# EAGLE design Mega Breakout with more GNDs 2 (EAGLE 9.6.2)
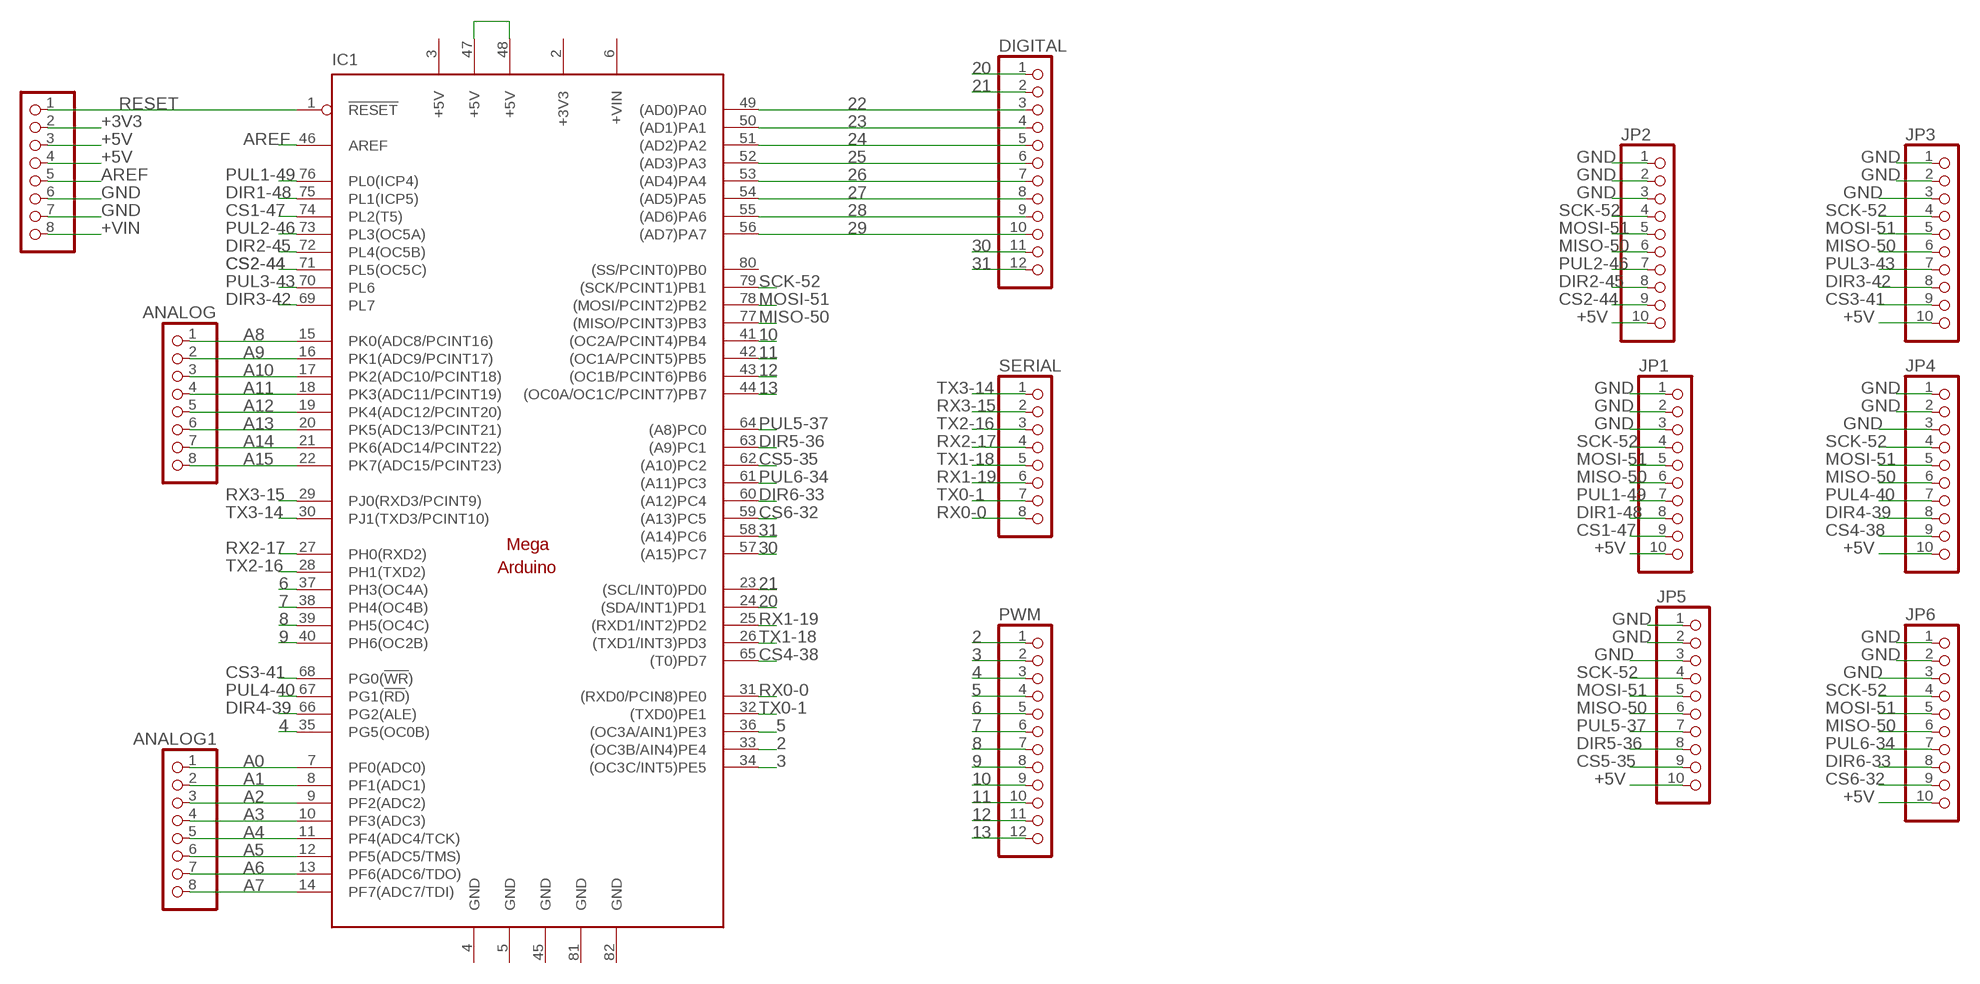
[diagram p0: schematic, sheet 1]

## Parts
ANALOG  PINHD-1X8  [1X08]
ANALOG1  PINHD-1X8  [1X08]
DIGITAL  PINHD-1X12  [1X12]
IC1  MEGAARDUINO_1  [MEGA_ARDUINO]
JP1  PINHD-1X10  [1X10]
JP2  PINHD-1X10  [1X10]
JP3  PINHD-1X10  [1X10]
JP4  PINHD-1X10  [1X10]
JP5  PINHD-1X10  [1X10]
JP6  PINHD-1X10  [1X10]
POWER  PINHD-1X8  [1X08]
PWM  PINHD-1X12  [1X12]
SERIAL  PINHD-1X8  [1X08]

## Nets
2: IC1.33((OC3B/AIN4)PE4) PWM.1
3: IC1.34((OC3C/INT5)PE5) PWM.2
4: IC1.35(PG5(OC0B)) PWM.3
5: IC1.36((OC3A/AIN1)PE3) PWM.4
6: IC1.37(PH3(OC4A)) PWM.5
7: IC1.38(PH4(OC4B)) PWM.6
8: IC1.39(PH5(OC4C)) PWM.7
9: IC1.40(PH6(OC2B)) PWM.8
10: IC1.41((OC2A/PCINT4)PB4) PWM.9
11: IC1.42((OC1A/PCINT5)PB5) PWM.10
12: IC1.43((OC1B/PCINT6)PB6) PWM.11
13: IC1.44((OC0A/OC1C/PCINT7)PB7) PWM.12
20: DIGITAL.1 IC1.24((SDA/INT1)PD1)
21: DIGITAL.2 IC1.23((SCL/INT0)PD0)
22: DIGITAL.3 IC1.49((AD0)PA0)
23: DIGITAL.4 IC1.50((AD1)PA1)
24: DIGITAL.5 IC1.51((AD2)PA2)
25: DIGITAL.6 IC1.52((AD3)PA3)
26: DIGITAL.7 IC1.53((AD4)PA4)
27: DIGITAL.8 IC1.54((AD5)PA5)
28: DIGITAL.9 IC1.55((AD6)PA6)
29: DIGITAL.10 IC1.56((AD7)PA7)
30: DIGITAL.11 IC1.57((A15)PC7)
31: DIGITAL.12 IC1.58((A14)PC6)
+3V3: POWER.2
+5V: JP1.10 JP2.10 JP3.10 JP4.10 JP5.10 JP6.10 POWER.3 POWER.4
+VIN: POWER.8
A0: ANALOG1.1 IC1.7(PF0(ADC0))
A1: ANALOG1.2 IC1.8(PF1(ADC1))
A2: ANALOG1.3 IC1.9(PF2(ADC2))
A3: ANALOG1.4 IC1.10(PF3(ADC3))
A4: ANALOG1.5 IC1.11(PF4(ADC4/TCK))
A5: ANALOG1.6 IC1.12(PF5(ADC5/TMS))
A6: ANALOG1.7 IC1.13(PF6(ADC6/TDO))
A7: ANALOG1.8 IC1.14(PF7(ADC7/TDI))
A8: ANALOG.1 IC1.15(PK0(ADC8/PCINT16))
A9: ANALOG.2 IC1.16(PK1(ADC9/PCINT17))
A10: ANALOG.3 IC1.17(PK2(ADC10/PCINT18))
A11: ANALOG.4 IC1.18(PK3(ADC11/PCINT19))
A12: ANALOG.5 IC1.19(PK4(ADC12/PCINT20))
A13: ANALOG.6 IC1.20(PK5(ADC13/PCINT21))
A14: ANALOG.7 IC1.21(PK6(ADC14/PCINT22))
A15: ANALOG.8 IC1.22(PK7(ADC15/PCINT23))
AREF: IC1.46(AREF) POWER.5
CS1-47: IC1.74(PL2(T5)) JP1.9
CS2-44: IC1.71(PL5(OC5C)) JP2.9
CS3-41: IC1.68(PG0(!WR!)) JP3.9
CS4-38: IC1.65((T0)PD7) JP4.9
CS5-35: IC1.62((A10)PC2) JP5.9
CS6-32: IC1.59((A13)PC5) JP6.9
DIR1-48: IC1.75(PL1(ICP5)) JP1.8
DIR2-45: IC1.72(PL4(OC5B)) JP2.8
DIR3-42: IC1.69(PL7) JP3.8
DIR4-39: IC1.66(PG2(ALE)) JP4.8
DIR5-36: IC1.63((A9)PC1) JP5.8
DIR6-33: IC1.60((A12)PC4) JP6.8
GND: JP1.1 JP1.2 JP1.3 JP2.1 JP2.2 JP2.3 JP3.1 JP3.2 JP3.3 JP4.1 JP4.2 JP4.3 JP5.1 JP5.2 JP5.3 JP6.1 JP6.2 JP6.3 POWER.6 POWER.7
MISO-50: IC1.77((MISO/PCINT3)PB3) JP1.6 JP2.6 JP3.6 JP4.6 JP5.6 JP6.6
MOSI-51: IC1.78((MOSI/PCINT2)PB2) JP1.5 JP2.5 JP3.5 JP4.5 JP5.5 JP6.5
N$1: IC1.47(+5V) IC1.48(+5V)
PUL1-49: IC1.76(PL0(ICP4)) JP1.7
PUL2-46: IC1.73(PL3(OC5A)) JP2.7
PUL3-43: IC1.70(PL6) JP3.7
PUL4-40: IC1.67(PG1(!RD!)) JP4.7
PUL5-37: IC1.64((A8)PC0) JP5.7
PUL6-34: IC1.61((A11)PC3) JP6.7
RESET: IC1.1(!RESET) POWER.1
RX0-0: IC1.31((RXD0/PCIN8)PE0) SERIAL.8
RX1-19: IC1.25((RXD1/INT2)PD2) SERIAL.6
RX2-17: IC1.27(PH0(RXD2)) SERIAL.4
RX3-15: IC1.29(PJ0(RXD3/PCINT9)) SERIAL.2
SCK-52: IC1.79((SCK/PCINT1)PB1) JP1.4 JP2.4 JP3.4 JP4.4 JP5.4 JP6.4
TX0-1: IC1.32((TXD0)PE1) SERIAL.7
TX1-18: IC1.26((TXD1/INT3)PD3) SERIAL.5
TX2-16: IC1.28(PH1(TXD2)) SERIAL.3
TX3-14: IC1.30(PJ1(TXD3/PCINT10)) SERIAL.1
Unconnected: IC1.80((SS/PCINT0)PB0)

## Power pins joined to a net without a drawn wire
+3V3: IC1.2(+3V3)
+5V: IC1.3(+5V)
+VIN: IC1.6(+VIN)
GND: IC1.4(GND) IC1.5(GND) IC1.45(GND) IC1.81(GND) IC1.82(GND)

## Library data of the parts
ANALOG ANALOG1 POWER SERIAL = pinhead:PINHD-1X8: PIN HEADER
DIGITAL PWM = pinhead:PINHD-1X12: PIN HEADER
IC1 = arduino:MEGAARDUINO_1: The Arduino Mega is a microcontroller board based on the ATmega1280. - 54 digital input/output pins (of which 14 can be used as PWM outputs) - 16 analog inputs - 4 UARTs (hardware serial ports) - 16 MHz crystal oscillator - USB connection - power jack - ICSP header - reset button It contains everything needed to support the microcontroller; simply connect it to a computer with a USB cable or power it with a AC-to-DC adapter or battery to get started. The Mega is compatible with most shields designed for the Arduino Duemilanove or Diecimila. http://arduino.cc/en/Main/ArduinoBoardMega
JP1-JP6 = pinhead:PINHD-1X10: PIN HEADER

## Board
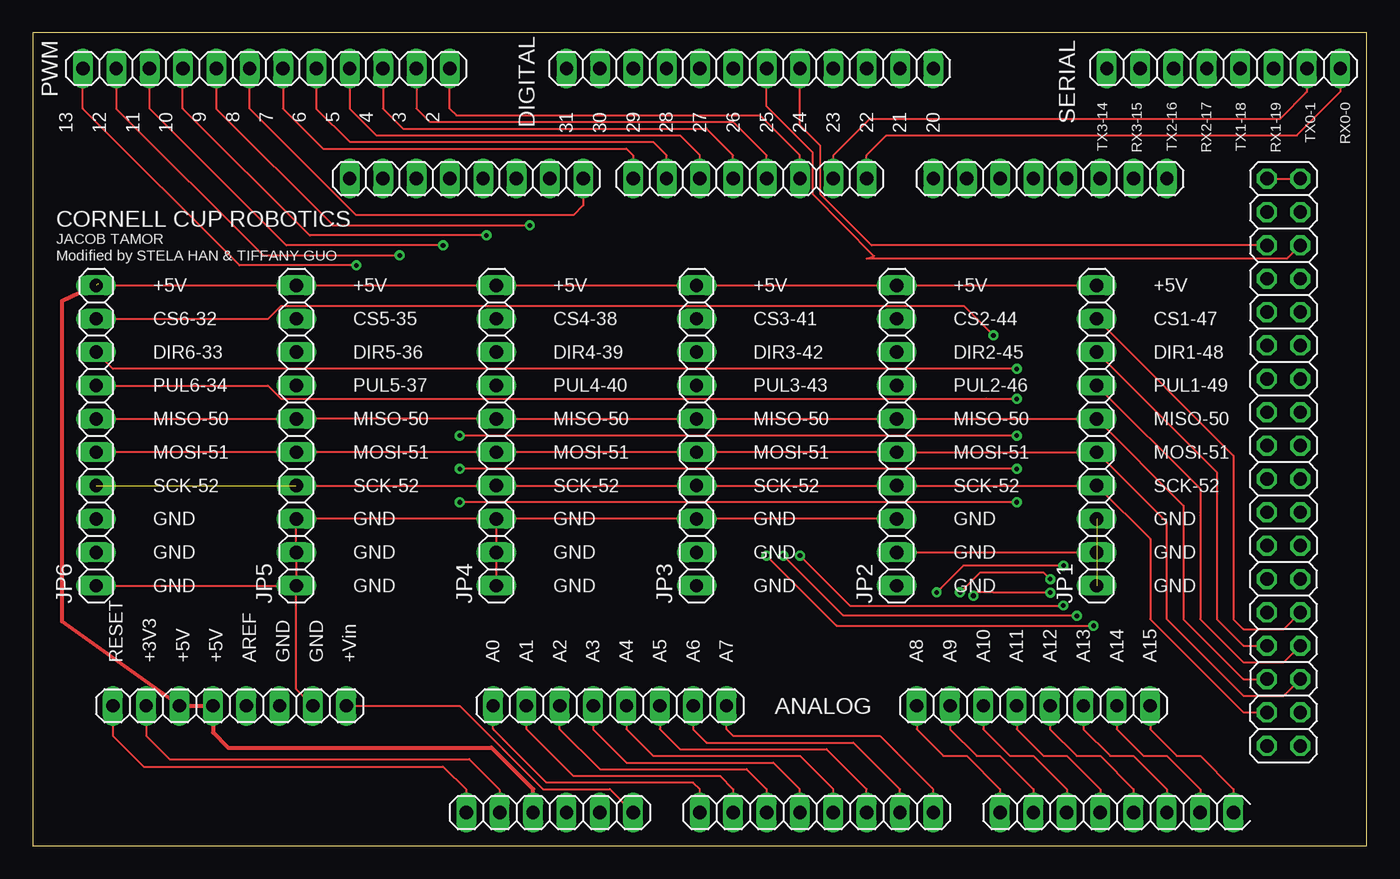
[diagram p1: board, top side]
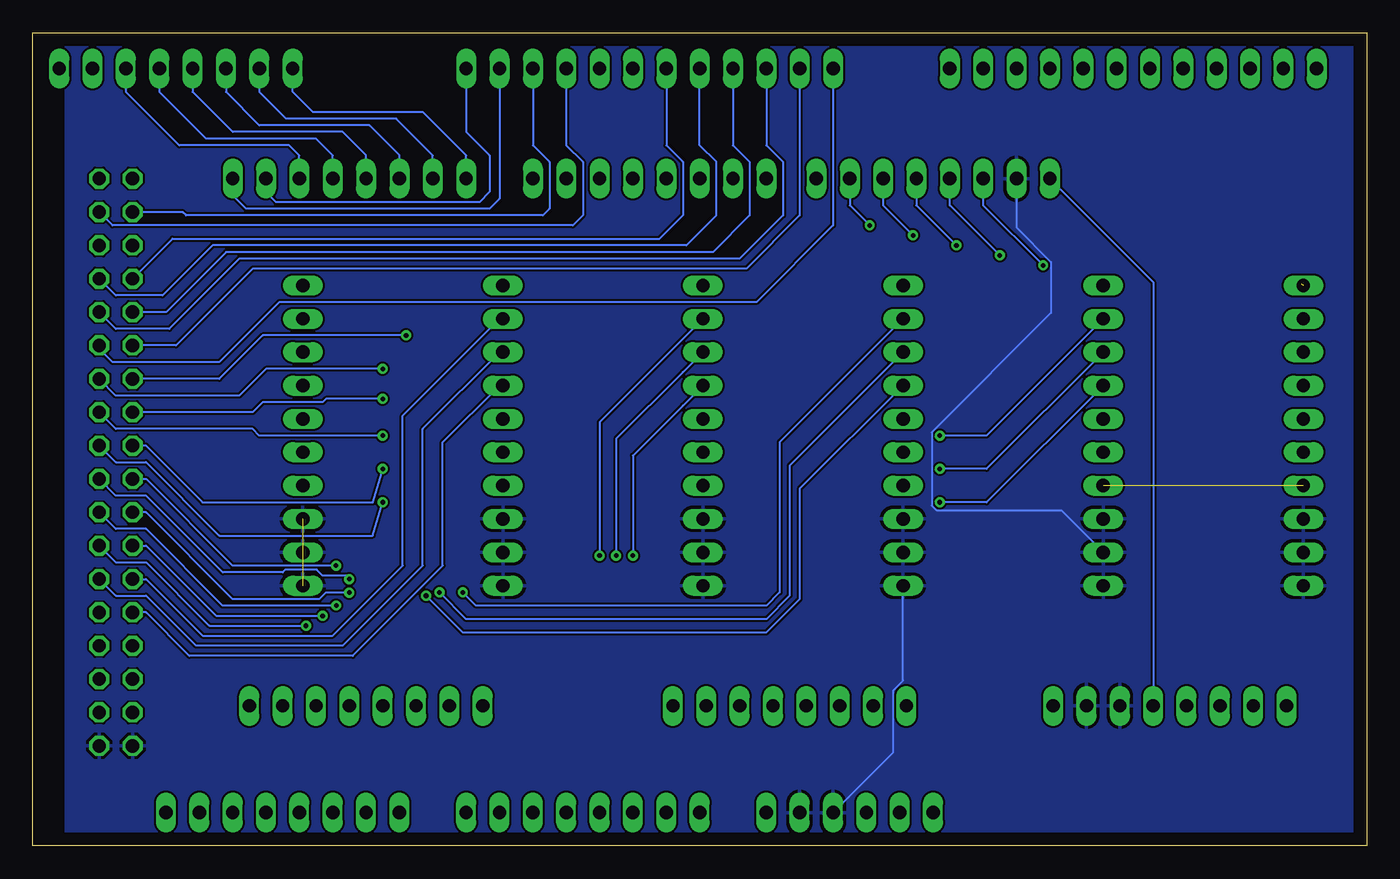
[diagram p2: board, bottom side, seen from below]

Size 101.58 x 61.9 mm. Coordinates in mm from the lower left corner, seen from the top.
Outline: 0,0 101.58,0 101.58,61.9 0,61.9 0,0
Copper layers (1*16): Top 0.035mm / dielectric 1.5mm / Bottom 0.035mm
Design rules "default": minimum track width 6mil, minimum drill 0.35mm, track to track 6mil, track to pad 6mil, pad to pad 6mil, via to via 6mil, smd to smd 6mil, copper to edge 40mil, drill to drill 6mil, minimum pad ring 10mil, minimum via ring 8mil, stop-mask expansion 4mil, vias tented up to drill 0mil, thermal gap 10mil

### Footprints (pad centres in the part's own frame; a part is rotated, then mirrored left to right if it is on the bottom)
1X08 = drill 1.016 long: 1 -8.89,0; 2 -6.35,0; 3 -3.81,0; 4 -1.27,0; 5 1.27,0; 6 3.81,0; 7 6.35,0; 8 8.89,0
1X12 = drill 1.016 long: 1 -13.97,0; 2 -11.43,0; 3 -8.89,0; 4 -6.35,0; 5 -3.81,0; 6 -1.27,0; 7 1.27,0; 8 3.81,0; 9 6.35,0; 10 8.89,0; 11 11.43,0; 12 13.97,0
MEGA_ARDUINO = drill 1.016 long: 1 33.02,2.54; 2 35.56,2.54; 3 38.1,2.54; 4 40.64,2.54; 5 43.18,2.54; 6 45.72,2.54; 7 50.8,2.54; 8 53.34,2.54; 9 55.88,2.54; 10 58.42,2.54; 11 60.96,2.54; 12 63.5,2.54; 13 66.04,2.54; 14 68.58,2.54; 15 73.66,2.54; 16 76.2,2.54; 17 78.74,2.54; 18 81.28,2.54; 19 83.82,2.54; 20 86.36,2.54; 21 88.9,2.54; 22 91.44,2.54; 23 86.36,50.8; 24 83.82,50.8; 25 81.28,50.8; 26 78.74,50.8; 27 76.2,50.8; 28 73.66,50.8; 29 71.12,50.8; 30 68.58,50.8; 31 63.5,50.8; 32 60.96,50.8; 33 58.42,50.8; 34 55.88,50.8; 35 53.34,50.8; 36 50.8,50.8; 37 48.26,50.8; 38 45.72,50.8; 39 41.91,50.8; 40 39.37,50.8; 41 36.83,50.8; 42 34.29,50.8; 43 31.75,50.8; 44 29.21,50.8; 45 26.67,50.8; 46 24.13,50.8 | drill 1.016 octagon: 47 93.98,50.8; 48 96.52,50.8; 49 93.98,48.26; 50 96.52,48.26; 51 93.98,45.72; 52 96.52,45.72; 53 93.98,43.18; 54 96.52,43.18; 55 93.98,40.64; 56 96.52,40.64; 57 93.98,38.1; 58 96.52,38.1; 59 93.98,35.56; 60 96.52,35.56; 61 93.98,33.02; 62 96.52,33.02; 63 93.98,30.48; 64 96.52,30.48; 65 93.98,27.94; 66 96.52,27.94; 67 93.98,25.4; 68 96.52,25.4; 69 93.98,22.86; 70 96.52,22.86; 71 93.98,20.32; 72 96.52,20.32; 73 93.98,17.78; 74 96.52,17.78; 75 93.98,15.24; 76 96.52,15.24; 77 93.98,12.7; 78 96.52,12.7; 79 93.98,10.16; 80 96.52,10.16; 81 93.98,7.62; 82 96.52,7.62
1X10 = drill 1.016 long: 1 -11.43,0; 2 -8.89,0; 3 -6.35,0; 4 -3.81,0; 5 -1.27,0; 6 1.27,0; 7 3.81,0; 8 6.35,0; 9 8.89,0; 10 11.43,0

### Placement (x,y rotation side)
ANALOG  76.2,10.67 0 top
ANALOG1  43.94,10.67 0 top
DIGITAL  54.61,59.18 180 top
IC1  0,0 0 top
JP1  81.03,31.24 90 top
JP2  65.79,31.24 90 top
JP3  50.55,31.24 90 top
JP4  35.31,31.24 90 top
JP5  20.07,31.24 90 top
JP6  4.83,31.24 90 top
POWER  14.99,10.67 0 top
PWM  17.78,59.18 180 top
SERIAL  90.68,59.18 0 top

### Tracks (layer width: path | path; a pad name or v marks a point on that pad's centre or on a via)
2
  Top 0.152: PWM.1 31.75,56.13 32.26,55.63 55.37,55.63 58.42,52.58 IC1.33
3
  Top 0.152: PWM.2 29.21,56.13 30.23,55.12 53.34,55.12 55.88,52.58 IC1.34
4
  Top 0.152: PWM.3 26.67,56.13 28.19,54.61 51.31,54.61 53.34,52.58 IC1.35
5
  Top 0.152: PWM.4 24.13,56.13 26.16,54.1 49.28,54.1 50.8,52.58 IC1.36
6
  Top 0.152: PWM.5 21.59,56.13 24.13,53.59 47.24,53.59 48.26,52.58 IC1.37
7
  Top 0.152: PWM.6 19.05,56.13 22.1,53.09 45.21,53.09 45.72,52.58 IC1.38
8
  Top 0.152: IC1.39 41.91,48.77 41.17,48.03 24.61,48.03 16.51,56.13 PWM.7
9  (via drill 0.35)
  Top 0.152: PWM.8 13.97,56.13 22.86,47.24 v37.85,47.24
  Bottom 0.152: IC1.40 39.37,48.77 v37.85,47.24
10  (via drill 0.35)
  Top 0.152: v34.54,46.48 21.08,46.48 11.43,56.13 PWM.9
  Bottom 0.152: IC1.41 36.83,48.77 v34.54,46.48
11  (via drill 0.35)
  Top 0.152: v31.24,45.72 19.3,45.72 8.89,56.13 PWM.10
  Bottom 0.152: IC1.42 34.29,48.77 v31.24,45.72
12  (via drill 0.35)
  Top 0.152: PWM.11 6.35,56.13 17.53,44.96 v27.94,44.96
  Bottom 0.152: IC1.43 31.75,48.77 v27.94,44.96
13  (via drill 0.35)
  Top 0.152: v24.64,44.2 15.75,44.2 3.81,56.13 PWM.12
  Bottom 0.152: IC1.44 29.21,48.77 v24.64,44.2
20
  Bottom 0.152: IC1.24 83.82,49.78 83.06,49.02 67.56,49.02 66.8,49.78 66.8,52.58 68.58,54.36 DIGITAL.1
21
  Bottom 0.152: IC1.23 86.36,49.53 85.34,48.51 66.8,48.51 66.04,49.28 DIGITAL.2
22
  Bottom 0.152: DIGITAL.3 63.5,53.34 62.23,52.07 62.23,48.51 62.74,48.01 89.92,48.01 90.17,48.26 IC1.49
23
  Bottom 0.152: DIGITAL.4 60.96,53.34 59.69,52.07 59.69,48.01 60.45,47.24 95.5,47.24 IC1.50
24
  Top 0.152: IC1.51 63.88,45.72 59.97,49.63 59.97,53.31 58.42,54.86 DIGITAL.5
25
  Top 0.152: IC1.52 95.5,44.7 63.5,44.7 64.07,44.89 59.41,49.63 59.41,52.78 55.88,56.31 DIGITAL.6
26
  Bottom 0.152: DIGITAL.7 53.34,53.34 52.07,52.07 52.07,48.01 53.85,46.23 90.93,46.23 IC1.53
27
  Bottom 0.152: IC1.54 95.25,41.91 91.69,41.91 87.88,45.72 51.82,45.72 49.53,48.01 49.53,52.07 50.8,53.34 DIGITAL.8
28
  Bottom 0.152: DIGITAL.9 48.26,53.34 46.99,52.07 46.99,48.01 49.78,45.21 86.87,45.21 91.44,40.64 IC1.55
29
  Bottom 0.152: DIGITAL.10 45.72,53.34 44.45,52.07 44.45,48.01 47.75,44.7 85.85,44.7 91.19,39.37 95.25,39.37 IC1.56
30
  Bottom 0.152: DIGITAL.11 43.18,48.01 47.24,43.94 84.84,43.94 90.68,38.1 IC1.57
31
  Bottom 0.152: IC1.58 96.52,37.85 95.5,36.83 87.38,36.83 82.8,41.4 46.48,41.4 40.64,47.24 DIGITAL.12
+3V3
  Top 0.152: POWER.2 8.64,8.38 10.41,6.6 33.23,6.6 35.56,4.27 IC1.2
+5V  (1 unrouted)
  Top 0.152: JP6.10 JP5.10 JP4.10 JP3.10 JP2.10 JP1.10
  Top 0.305: IC1.3 38.1,4.32 34.92,7.49 14.86,7.49 13.72,8.64 POWER.4 POWER.3 2.24,17.07 2.24,41.49 4.96,42.79
+VIN
  Top 0.152: POWER.8 32.51,10.67 38.86,4.32 43.94,4.32 IC1.6
A0
  Top 0.152: ANALOG1.1 35.05,8.89 39.12,4.83 50.29,4.83 50.8,4.32 IC1.7
A1
  Top 0.152: ANALOG1.2 37.59,8.89 41.15,5.33 52.32,5.33 53.34,4.32 IC1.8
A2
  Top 0.152: ANALOG1.3 40.13,8.89 43.18,5.84 54.36,5.84 55.88,4.32 IC1.9
A3
  Top 0.152: ANALOG1.4 42.67,8.89 45.21,6.35 56.39,6.35 58.42,4.32 IC1.10
A4
  Top 0.152: ANALOG1.5 45.21,8.89 47.24,6.86 58.42,6.86 60.96,4.32 IC1.11
A5
  Top 0.152: ANALOG1.6 47.75,8.89 49.28,7.37 60.45,7.37 63.5,4.32 IC1.12
A6
  Top 0.152: ANALOG1.7 50.29,8.89 51.31,7.87 62.48,7.87 66.04,4.32 IC1.13
A7
  Top 0.152: ANALOG1.8 52.83,8.89 53.34,8.38 64.52,8.38 68.58,4.32 IC1.14
A8
  Top 0.152: ANALOG.1 67.31,8.89 69.34,6.86 71.12,6.86 73.66,4.32 IC1.15
A9
  Top 0.152: ANALOG.2 69.85,8.89 71.88,6.86 73.66,6.86 76.2,4.32 IC1.16
A10
  Top 0.152: ANALOG.3 72.39,8.89 74.42,6.86 76.2,6.86 78.74,4.32 IC1.17
A11
  Top 0.152: ANALOG.4 74.93,8.89 76.96,6.86 78.74,6.86 81.28,4.32 IC1.18
A12
  Top 0.152: ANALOG.5 77.47,8.89 79.5,6.86 81.28,6.86 83.82,4.32 IC1.19
A13
  Top 0.152: ANALOG.6 80.01,8.89 82.04,6.86 83.82,6.86 86.36,4.32 IC1.20
A14
  Top 0.152: ANALOG.7 82.55,8.89 84.58,6.86 86.36,6.86 88.9,4.32 IC1.21
A15
  Top 0.152: ANALOG.8 85.09,8.89 87.12,6.86 88.9,6.86 91.44,4.32 IC1.22
AREF
  Bottom 0.152: IC1.46 16.26,42.93 POWER.5
CS1-47
  Top 0.152: IC1.74 95.25,16.51 92.2,16.51 91.44,17.27 91.44,29.72 JP1.9
CS2-44
  Bottom 0.152: IC1.71 92.96,20.32 88.65,16 78.74,16 73.41,21.34 73.41,32.77 66.04,40.13 JP2.9
CS3-41  (via drill 0.35)
  Top 0.152: v58.42,22.1 62.21,18.3 v78.47,18.3
  Bottom 0.152: v58.42,22.1 58.42,32.26 52.27,38.41 52.07,38.61 JP3.9 | v78.47,18.3 87.14,18.3 92.96,24.13 95.25,24.13 IC1.68
CS4-38  (via drill 0.35)
  Top 0.152: v78.49,21.34 70.87,21.34 v68.83,19.3
  Bottom 0.152: IC1.65 92.96,27.94 86.36,21.34 v78.49,21.34 | JP4.9 44.7,30.73 44.7,19.3 45.72,18.29 67.82,18.29 67.95,18.41 v68.83,19.3
CS5-35  (via drill 0.35)
  Top 0.152: v74.93,31.24 v32.51,31.24
  Bottom 0.152: JP5.9 28.96,31.24 v32.51,31.24 | IC1.62 95.25,31.75 84.84,31.75 84.33,31.24 v74.93,31.24
CS6-32  (via drill 0.35)
  Top 0.152: JP6.9 17.9,40.13 18.89,41.12 70.89,41.12 v73.15,38.86
  Bottom 0.152: IC1.59 87.38,35.56 84.07,38.86 v73.15,38.86
DIR1-48
  Top 0.152: IC1.75 92.2,15.24 90.17,17.27 90.17,26.42 90.17,26.67 90.17,28.45 JP1.8
DIR2-45
  Bottom 0.152: IC1.72 95.25,19.05 92.96,19.05 89.15,15.24 77.98,15.24 71.88,21.34 71.88,31.75 66.04,37.59 JP2.8
DIR3-42  (via drill 0.35)
  Top 0.152: v57.15,22.1 61.72,17.53 v79.51,17.52
  Bottom 0.152: IC1.69 92.96,22.86 87.64,17.53 v79.52,17.52 v79.51,17.52 | JP3.8 52.07,36.07 57.15,30.99 v57.15,22.1
DIR4-39  (via drill 0.35)
  Top 0.152: v70.61,19.3 70.63,19.3 72.15,20.83 76.96,20.83 v77.48,20.31
  Bottom 0.152: JP4.8 43.94,28.96 43.94,19.05 45.72,17.27 68.58,17.27 v70.61,19.3 | IC1.66 95.25,26.67 92.96,26.67 87.12,20.83 | 87.12,20.83 87.11,20.82 | v77.48,20.31 77.74,20.57 79.5,20.57 79.96,21.03 82.35,21.03 82.55,20.83 87.12,20.83
DIR5-36  (via drill 0.35)
  Top 0.152: v74.93,28.7 v32.51,28.7
  Bottom 0.152: JP5.8 28.96,28.7 v32.51,28.7 | v74.93,28.7 75.69,26.16 88.65,26.16 92.96,30.48 IC1.63
DIR6-33  (via drill 0.35)
  Top 0.152: v74.93,36.32 6.1,36.32 JP6.8
  Bottom 0.152: IC1.60 95.25,34.29 85.85,34.29 83.82,36.32 v74.93,36.32
GND  (2 unrouted)
  Top 0.152: JP6.1 JP5.1 | POWER.7 20.07,11.94 JP5.1 | JP2.3 JP3.3 JP4.3 | JP4.3 JP5.3 JP5.2 JP5.1 | JP4.1 JP4.2 JP4.3 | JP2.2 JP1.2
  Bottom 0.152: IC1.45 26.67,47.09 24.03,44.45 24.03,40.58 33.12,31.49 33.12,25.91 32.76,25.55 23.27,25.55 JP5.2 | JP4.1 35.31,12.58 36.04,11.84 36.04,7.14 IC1.4
  pour Bottom: 0.76,61.72 0.76,0 99.06,0 99.06,61.72
MISO-50
  Top 0.152: IC1.77 92.2,12.7 87.63,17.27 87.63,25.91 JP1.6 JP2.6 JP3.6 JP4.6 JP5.6 JP6.6
MOSI-51
  Top 0.152: IC1.78 95.25,11.43 92.2,11.43 86.36,17.27 86.36,24.64 81.15,29.84 JP1.5 JP2.5 JP3.5 JP4.5 JP5.5 JP6.5
N$1
  Top 0.152: IC1.47 IC1.48
PUL1-49
  Top 0.152: IC1.76 95.25,13.97 92.2,13.97 88.9,17.27 88.9,25.15 88.9,25.4 88.9,27.18 JP1.7
PUL2-46
  Bottom 0.152: IC1.73 92.96,17.78 89.66,14.48 77.22,14.48 70.36,21.34 70.36,30.73 66.04,35.05 JP2.7
PUL3-43  (via drill 0.35)
  Top 0.152: v55.88,22.1 61.21,16.76 v80.77,16.76
  Bottom 0.152: IC1.70 95.25,21.59 92.96,21.59 88.14,16.76 v80.77,16.76 | JP3.7 52.07,33.53 55.88,29.72 v55.88,22.1
PUL4-40  (via drill 0.35)
  Top 0.152: v77.48,19.29 73.17,19.29 73.15,19.3 71.88,19.3 v71.63,19.05
  Bottom 0.152: JP4.7 43.18,27.18 43.18,18.8 45.72,16.26 68.83,16.26 v71.63,19.05 | IC1.67 92.96,25.4 86.34,18.78 79.77,18.78 79.26,19.29 v77.48,19.29
PUL5-37  (via drill 0.35)
  Top 0.152: v74.93,26.16 v32.51,26.16
  Bottom 0.152: IC1.64 95.25,29.21 92.96,29.21 87.38,23.62 75.69,23.62 v74.93,26.16 | JP5.7 28.96,26.16 v32.51,26.16
PUL6-34  (via drill 0.35)
  Top 0.152: JP6.7 17.9,35.05 18.89,34.06 72.62,34.06 v74.93,34.04
  Bottom 0.152: IC1.61 84.84,33.02 84.07,33.78 79.5,33.78 79.25,34.04 v74.93,34.04
RESET
  Top 0.152: IC1.1 33.02,4.27 31.24,6.04 8.43,6.04 6.1,8.38 POWER.1
RX0-0
  Top 0.152: IC1.31 63.5,52.58 65.02,54.1 96.27,54.1 99.57,57.4 SERIAL.8
RX1-19
  Bottom 0.152: IC1.25 81.28,52.58 82.04,53.34 90.42,53.34 94.49,57.4 SERIAL.6
RX2-17
  Bottom 0.152: IC1.27 76.2,52.58 77.98,54.36 86.36,54.36 89.41,57.4 SERIAL.4
RX3-15
  Bottom 0.152: SERIAL.2 84.33,57.4 82.3,55.37 73.91,55.37 71.12,52.58 IC1.29
SCK-52  (1 unrouted)
  Top 0.152: IC1.79 92.2,10.16 85.09,17.27 85.09,23.37 81.15,27.3 JP1.4 JP2.4 JP3.4 JP4.4 JP5.4
TX0-1
  Top 0.152: IC1.32 60.96,52.58 63.75,55.37 95,55.37 97.03,57.4 SERIAL.7
TX1-18
  Bottom 0.152: IC1.26 78.74,52.58 80.01,53.85 88.39,53.85 91.95,57.4 SERIAL.5
TX2-16
  Bottom 0.152: IC1.28 73.66,52.58 75.95,54.86 84.33,54.86 86.87,57.4 SERIAL.3
TX3-14
  Bottom 0.152: IC1.30 68.58,52.58 71.88,55.88 80.26,55.88 81.79,57.4 SERIAL.1

### Text on the board
tPlace: PWM | DIGITAL | SERIAL | TX3-14 / RX3-15 / TX2-16 / RX2-17 / TX1-18 / RX1-19 / TX0-1 / RX0-0 | 13 / 12 / 11 / 10 / 9 / 8 / 7 / 6 / 5 / 4 / 3 / 2 | 31 / 30 / 29 / 28 / 27 / 26 / 25 / 24 / 23 / 22 / 21 / 20 | CORNELL CUP ROBOTICS | JACOB TAMOR | Modified by STELA HAN & TIFFANY GUO | +5V / CS6-32 / DIR6-33 / PUL6-34 / MISO-50 / MOSI-51 / SCK-52 / GND / GND / GND | +5V / CS5-35 / DIR5-36 / PUL5-37 / MISO-50 / MOSI-51 / SCK-52 / GND / GND / GND | +5V / CS4-38 / DIR4-39 / PUL4-40 / MISO-50 / MOSI-51 / SCK-52 / GND / GND / GND | +5V / CS3-41 / DIR3-42 / PUL3-43 / MISO-50 / MOSI-51 / SCK-52 / GND / GND / GND | +5V / CS2-44 / DIR2-45 / PUL2-46 / MISO-50 / MOSI-51 / SCK-52 / GND / GND / GND | +5V / CS1-47 / DIR1-48 / PUL1-49 / MISO-50 / MOSI-51 / SCK-52 / GND / GND / GND | RESET / +3V3 / +5V / +5V / AREF / GND / GND / +Vin | A0 / A1 / A2 / A3 / A4 / A5 / A6 / A7 | A8 / A9 / A10 / A11 / A12 / A13 / A14 / A15 | ANALOG